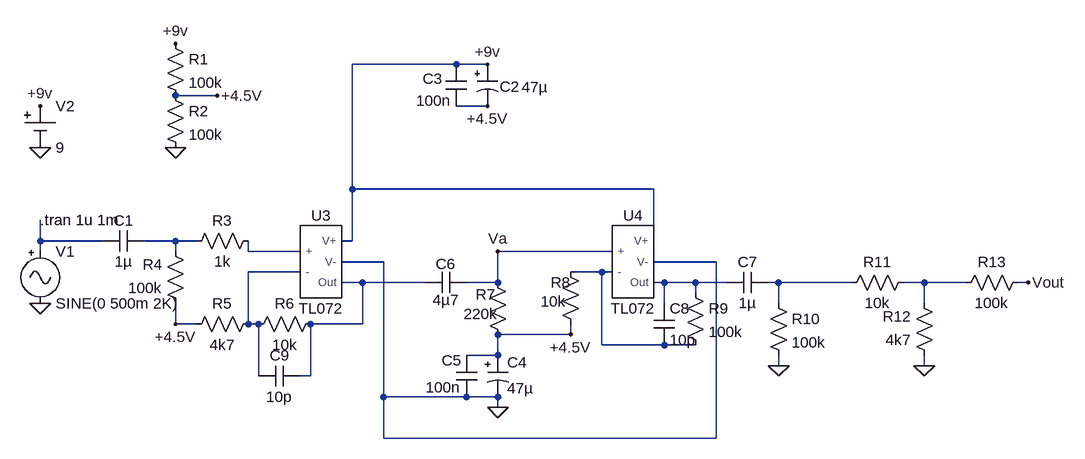
[diagram p0: schematic Volt.asc]
Volt.asc, the LTspice schematic file:
Version 4.1
SHEET 1 1892 680
WIRE 944 -16 784 -16
WIRE 992 -16 944 -16
WIRE 576 32 512 32
WIRE 992 48 944 48
WIRE 784 176 784 -16
WIRE 1248 176 784 176
WIRE 304 256 304 224
WIRE 400 256 304 256
WIRE 512 256 464 256
WIRE 544 256 512 256
WIRE 784 256 784 176
WIRE 784 256 768 256
WIRE 1248 256 1248 176
WIRE 304 272 304 256
WIRE 512 272 512 256
WIRE 624 272 624 256
WIRE 704 272 624 272
WIRE 1184 272 1008 272
WIRE 832 288 768 288
WIRE 1344 288 1248 288
WIRE 704 304 624 304
WIRE 1168 304 1120 304
WIRE 1184 304 1168 304
WIRE 800 320 768 320
WIRE 896 320 800 320
WIRE 1008 320 1008 272
WIRE 1008 320 960 320
WIRE 1264 320 1248 320
WIRE 1312 320 1264 320
WIRE 1360 320 1312 320
WIRE 1440 320 1424 320
WIRE 1552 320 1440 320
WIRE 1664 320 1632 320
WIRE 1728 320 1664 320
WIRE 1824 320 1808 320
WIRE 1312 336 1312 320
WIRE 1264 352 1264 320
WIRE 1440 352 1440 320
WIRE 1664 352 1664 320
WIRE 512 384 512 352
WIRE 544 384 512 384
WIRE 624 384 624 304
WIRE 640 384 624 384
WIRE 800 384 800 320
WIRE 800 384 720 384
WIRE 1120 400 1120 384
WIRE 1120 400 1008 400
WIRE 1168 416 1168 304
WIRE 1264 416 1168 416
WIRE 1312 416 1264 416
WIRE 1008 432 1008 400
WIRE 1008 432 960 432
WIRE 1440 448 1440 432
WIRE 1664 448 1664 432
WIRE 640 464 640 384
WIRE 720 464 720 384
WIRE 720 464 704 464
WIRE 832 496 832 288
WIRE 960 496 832 496
WIRE 1008 496 960 496
WIRE 1008 512 1008 496
WIRE 832 560 832 496
WIRE 1344 560 1344 288
WIRE 1344 560 832 560
FLAG 304 112 0
FLAG 304 48 +9v
FLAG 992 -16 +9v
FLAG 512 -48 +9v
FLAG 512 112 0
FLAG 576 32 +4.5V
FLAG 304 352 0
FLAG 1120 400 +4.5V
FLAG 512 384 +4.5V
FLAG 992 48 +4.5V
FLAG 1440 448 0
FLAG 1008 512 0
FLAG 1008 272 Va
FLAG 1664 448 0
FLAG 1824 320 Vout
SYMBOL Misc/signal 304 256 R0
SYMATTR InstName V1
SYMATTR Value SINE(0 500m 2K)
SYMBOL Misc/cell 304 48 R0
SYMATTR InstName V2
SYMATTR Value 9
SYMBOL Res 496 -64 R0
SYMATTR InstName R1
SYMATTR Value 100k
SYMBOL Res 496 16 R0
SYMATTR InstName R2
SYMATTR Value 100k
SYMBOL Cap 464 240 R90
WINDOW 0 0 32 VBottom 2
WINDOW 3 32 32 VTop 2
SYMATTR InstName C1
SYMATTR Value 1µ
SYMBOL Cap 960 48 R180
WINDOW 0 37 42 Left 2
WINDOW 3 24 8 Left 2
SYMATTR InstName C3
SYMATTR Value 100n
SYMBOL Cap 976 496 R180
WINDOW 0 24 56 Left 2
WINDOW 3 25 15 Left 2
SYMATTR InstName C5
SYMATTR Value 100n
SYMBOL polcap 976 -16 R0
WINDOW 0 35 34 Left 2
WINDOW 3 69 35 Left 2
SYMATTR InstName C2
SYMATTR Value 47µ
SYMBOL polcap 992 432 R0
WINDOW 0 30 11 Left 2
WINDOW 3 30 51 Left 2
SYMATTR InstName C4
SYMATTR Value 47µ
SYMBOL Res 640 240 R90
WINDOW 0 0 56 VBottom 2
WINDOW 3 32 56 VTop 2
SYMATTR InstName R3
SYMATTR Value 1k
SYMBOL Res 528 368 R180
WINDOW 0 36 76 Left 2
WINDOW 3 36 40 Left 2
SYMATTR InstName R4
SYMATTR Value 100k
SYMBOL Res 528 400 R270
WINDOW 0 32 56 VTop 2
WINDOW 3 0 56 VBottom 2
SYMATTR InstName R5
SYMATTR Value 4k7
SYMBOL Res 624 400 R270
WINDOW 0 32 56 VTop 2
WINDOW 3 0 56 VBottom 2
SYMATTR InstName R6
SYMATTR Value 10k
SYMBOL Res 1024 416 R180
WINDOW 0 19 78 Left 2
WINDOW 3 16 48 Left 2
SYMATTR InstName R7
SYMATTR Value 220k
SYMBOL Cap 960 304 R90
WINDOW 0 3 32 VBottom 2
WINDOW 3 27 32 VTop 2
SYMATTR InstName C6
SYMATTR Value 4µ7
SYMBOL Res 1104 288 R0
WINDOW 0 -15 32 Left 2
WINDOW 3 -30 61 Left 2
SYMATTR InstName R8
SYMATTR Value 10k
SYMBOL Res 1296 320 R0
SYMATTR InstName R9
SYMATTR Value 100k
SYMBOL Cap 1424 304 R90
WINDOW 0 0 32 VBottom 2
WINDOW 3 32 32 VTop 2
SYMATTR InstName C7
SYMATTR Value 1µ
SYMBOL Res 1424 336 R0
SYMATTR InstName R10
SYMATTR Value 100k
SYMBOL Res 1648 304 R90
WINDOW 0 0 56 VBottom 2
WINDOW 3 32 56 VTop 2
SYMATTR InstName R11
SYMATTR Value 10k
SYMBOL Res 1680 448 R180
WINDOW 0 36 76 Left 2
WINDOW 3 36 40 Left 2
SYMATTR InstName R12
SYMATTR Value 4k7
SYMBOL Res 1824 304 R90
WINDOW 0 0 56 VBottom 2
WINDOW 3 32 56 VTop 2
SYMATTR InstName R13
SYMATTR Value 100k
SYMBOL TL072CN\\TL072 736 288 R0
SYMATTR InstName U3
SYMBOL TL072CN\\TL072 1216 288 R0
SYMATTR InstName U4
SYMBOL cap 1248 352 R0
SYMATTR InstName C8
SYMATTR Value 10p
SYMBOL cap 704 448 R90
WINDOW 0 0 32 VBottom 2
WINDOW 3 32 32 VTop 2
SYMATTR InstName C9
SYMATTR Value 10p
TEXT 304 224 Left 2 !.tran 1u 1m

The netlist it stands for:
* Volt.asc
V1 N001 0 SINE(0 500m 2K)
V2 +9v 0 9
R1 +9v +4.5V 100k
R2 +4.5V 0 100k
C1 N002 N001 1µ
C3 +4.5V +9v 100n
C5 0 +4.5V 100n
C2 +9v +4.5V 47µ
C4 +4.5V 0 47µ
R3 N003 N002 1k
R4 +4.5V N002 100k
R5 +4.5V N004 4k7
R6 N004 N006 10k
R7 +4.5V Va 220k
C6 Va N006 4µ7
R8 N005 +4.5V 10k
R9 N007 N005 100k
C7 N008 N007 1µ
R10 N008 0 100k
R11 N009 N008 10k
R12 0 N009 4k7
R13 Vout N009 100k
X§U3 N003 N004 +9v 0 N006 TL072  ; pins + - V+ V- Out
X§U4 Va N005 +9v 0 N007 TL072  ; pins + - V+ V- Out
C8 N007 N005 10p
C9 N006 N004 10p
.tran 1u 1m
.lib C:\users\ben_wang\Desktop\everything\Code\volt\pcb\TL072CN\TL072.sub
.backanno
.end